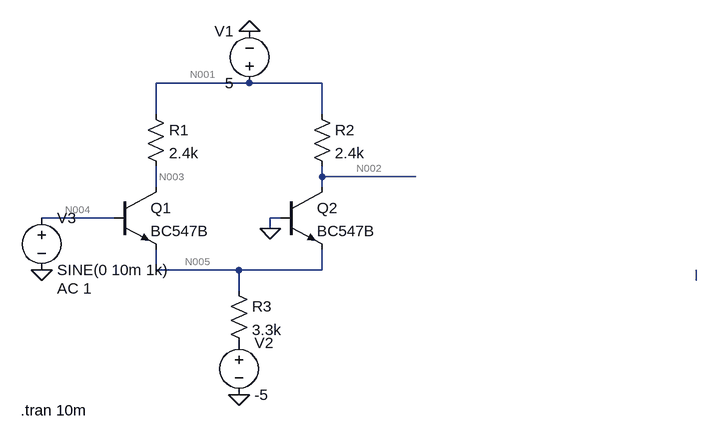
[diagram p0: schematic preamp.asc]
preamp.asc, the LTspice schematic file:
Version 4
SHEET 1 920 680
WIRE 192 128 48 128
WIRE 304 128 192 128
WIRE 48 176 48 128
WIRE 304 176 304 128
WIRE 304 272 304 256
WIRE 448 272 304 272
WIRE 48 288 48 256
WIRE 304 288 304 272
WIRE -16 336 -128 336
WIRE 240 336 224 336
WIRE 224 352 224 336
WIRE 48 416 48 384
WIRE 176 416 48 416
WIRE 304 416 304 384
WIRE 304 416 176 416
WIRE 880 432 880 416
WIRE 176 448 176 416
FLAG 224 352 0
FLAG 176 608 0
FLAG -128 416 0
FLAG 192 48 0
SYMBOL voltage 192 144 R180
WINDOW 0 24 96 Left 2
WINDOW 3 24 16 Left 2
WINDOW 123 0 0 Left 0
WINDOW 39 0 0 Left 0
SYMATTR InstName V1
SYMATTR Value 5
SYMBOL res 32 160 R0
SYMATTR InstName R1
SYMATTR Value 2.4k
SYMBOL res 288 160 R0
SYMATTR InstName R2
SYMATTR Value 2.4k
SYMBOL npn -16 288 R0
SYMATTR InstName Q1
SYMATTR Value BC547B
SYMBOL npn 240 288 R0
SYMATTR InstName Q2
SYMATTR Value BC547B
SYMBOL res 160 432 R0
SYMATTR InstName R3
SYMATTR Value 3.3k
SYMBOL voltage 176 512 R0
WINDOW 123 0 0 Left 0
WINDOW 39 0 0 Left 0
SYMATTR InstName V2
SYMATTR Value -5
SYMBOL voltage -128 320 R0
WINDOW 123 24 124 Left 2
WINDOW 39 0 0 Left 0
SYMATTR Value2 AC 1
SYMATTR InstName V3
SYMATTR Value SINE(0 10m 1k)
TEXT -160 632 Left 2 !.tran 10m

The netlist it stands for:
* preamp.asc
V1 N001 0 5
R1 N001 N003 2.4k
R2 N001 N002 2.4k
Q1 N003 N004 N005 0 BC547B
Q2 N002 0 N005 0 BC547B
R3 N005 P001 3.3k
V2 P001 0 -5
V3 N004 0 SINE(0 10m 1k) AC 1
.model NPN NPN
.model PNP PNP
.lib standard.bjt
.tran 10m
.backanno
.end

* Results of the author's LTspice run, read from the files saved beside the schematic
* Operating Point, zero values left out:
*   V(n001) = 5 V
*   V(n003) = 3.415 V
*   V(n002) = 3.415 V
*   V(n005) = -626.5 mV
*   V(p001) = -5 V
*   Ic(Q2) = 660.4 µA
*   Ib(Q2) = 2.213 µA
*   Ie(Q2) = -662.7 µA
*   Ic(Q1) = 660.4 µA
*   Ib(Q1) = 2.213 µA
*   Ie(Q1) = -662.7 µA
*   I(R3) = 1.325 mA
*   I(R2) = 660.4 µA
*   I(R1) = 660.4 µA
*   I(V3) = -2.213 µA
*   I(V2) = 1.325 mA
*   I(V1) = -1.321 mA
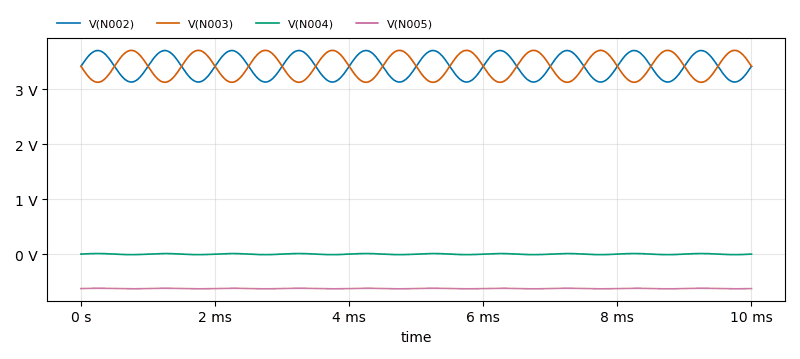
[diagram p1: Transient Analysis of preamp.asc, plotted from the saved traces]
* Transient Analysis, 1 run:
*   V(N002): min 3.129 V, max 3.702 V, average 3.415 V, rms 3.421 V, last 3.415 V
*   V(N003): min 3.124 V, max 3.704 V, average 3.415 V, rms 3.421 V, last 3.415 V
*   V(N004): min -10 mV, max 10 mV, average -61.3 nV, rms 7.086 mV, last 0 V
*   V(N005): min -631 mV, max -621.1 mV, average -626.3 mV, rms 626.3 mV, last -626.5 mV